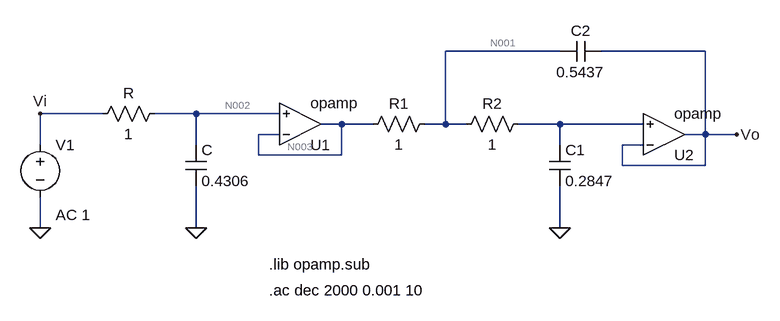
[diagram p0: schematic todo_normalizado_ejercicio4.asc]
todo_normalizado_ejercicio4.asc, the LTspice schematic file:
Version 4.1
SHEET 1 960 680
WIRE 640 32 464 32
WIRE 864 32 704 32
WIRE -64 128 -160 128
WIRE 80 128 16 128
WIRE 208 128 80 128
WIRE 304 144 272 144
WIRE 352 144 304 144
WIRE 464 144 464 32
WIRE 464 144 432 144
WIRE 496 144 464 144
WIRE 640 144 576 144
WIRE 768 144 640 144
WIRE 208 160 176 160
WIRE 864 160 864 32
WIRE 864 160 832 160
WIRE 912 160 864 160
WIRE -160 176 -160 128
WIRE 80 176 80 128
WIRE 640 176 640 144
WIRE 768 176 736 176
WIRE 176 192 176 160
WIRE 304 192 304 144
WIRE 304 192 176 192
WIRE 736 208 736 176
WIRE 864 208 864 160
WIRE 864 208 736 208
WIRE -160 304 -160 256
WIRE 80 304 80 240
WIRE 640 304 640 240
FLAG -160 304 0
FLAG 80 304 0
FLAG 640 304 0
FLAG -160 128 Vi
FLAG 912 160 Vo
SYMBOL res 32 112 R90
WINDOW 0 0 56 VBottom 2
WINDOW 3 32 56 VTop 2
SYMATTR InstName R
SYMATTR Value 1
SYMBOL cap 64 176 R0
SYMATTR InstName C
SYMATTR Value 0.4306
SYMBOL OpAmps\\opamp 240 208 M180
SYMATTR InstName U1
SYMBOL OpAmps\\opamp 800 224 M180
SYMATTR InstName U2
SYMBOL res 448 128 R90
WINDOW 0 0 56 VBottom 2
WINDOW 3 32 56 VTop 2
SYMATTR InstName R1
SYMATTR Value 1
SYMBOL res 592 128 R90
WINDOW 0 0 56 VBottom 2
WINDOW 3 32 56 VTop 2
SYMATTR InstName R2
SYMATTR Value 1
SYMBOL cap 624 176 R0
SYMATTR InstName C1
SYMATTR Value 0.2847
SYMBOL cap 704 16 R90
WINDOW 0 0 32 VBottom 2
WINDOW 3 32 32 VTop 2
SYMATTR InstName C2
SYMATTR Value 0.5437
SYMBOL voltage -160 160 R0
WINDOW 3 24 152 Left 2
WINDOW 123 24 124 Left 2
WINDOW 39 0 0 Left 0
SYMATTR InstName V1
SYMATTR Value ""
SYMATTR Value2 AC 1
TEXT 192 360 Left 2 !.lib opamp.sub
TEXT 192 400 Left 2 !.ac dec 2000 0.001 10

The netlist it stands for:
* todo_normalizado_ejercicio4.asc
R N002 Vi 1
C N002 0 0.4306
X§U1 N003 N002 N003 opamp Aol=100K GBW=10Meg  ; pins invin noninvin out
X§U2 Vo N004 Vo opamp Aol=100K GBW=10Meg  ; pins invin noninvin out
R1 N001 N003 1
R2 N004 N001 1
C1 N004 0 0.2847
C2 Vo N001 0.5437
V1 Vi 0 AC 1
.lib opamp.sub
.ac dec 2000 0.001 10
.backanno
.end

* Results of the author's LTspice run, read from the files saved beside the schematic
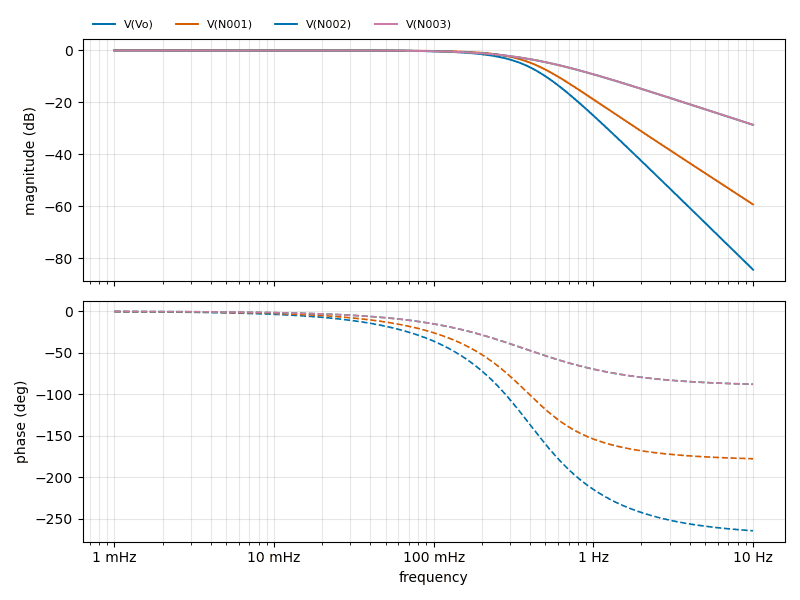
[diagram p1: AC Analysis of todo_normalizado_ejercicio4.asc, plotted from the saved traces]
* AC Analysis, 1 run:
*   V(Vo): -0.00 dB at 1 mHz, -84.43 dB at 10 Hz, peak -0.00 dB at 1 mHz, 3 dB below the peak at 279.4 mHz
*   V(N001): -0.00 dB at 1 mHz, -59.31 dB at 10 Hz, peak -0.00 dB at 1 mHz, 3 dB below the peak at 329.3 mHz
*   V(N002): -0.00 dB at 1 mHz, -28.65 dB at 10 Hz, peak -0.00 dB at 1 mHz, 3 dB below the peak at 369.6 mHz
*   V(N003): -0.00 dB at 1 mHz, -28.65 dB at 10 Hz, peak -0.00 dB at 1 mHz, 3 dB below the peak at 369.6 mHz